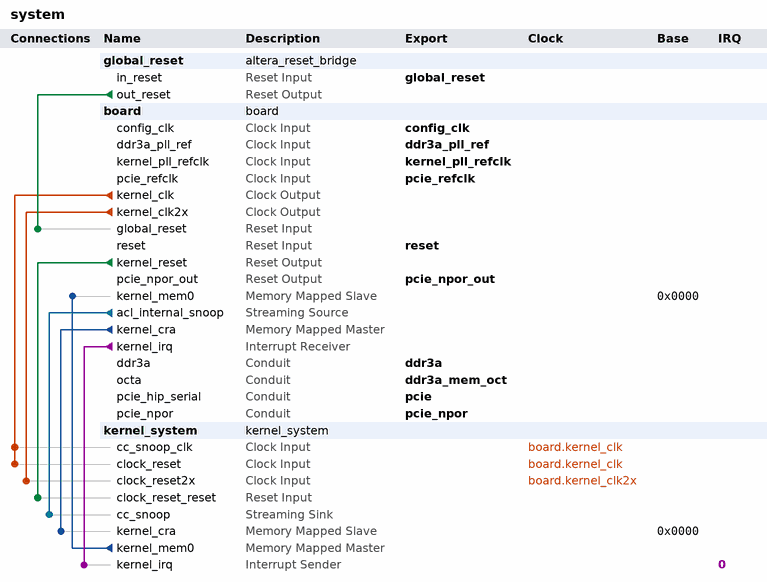
[diagram p0: system contents]
# Platform Designer (Qsys) system system, Cyclone V 5CGXFC9D6F27C7
# Parameters at their usual value, and those the tool derives, are not listed.
package require -exact qsys 18.1
create_system system
set_project_property DEVICE_FAMILY {Cyclone V}
set_project_property DEVICE 5CGXFC9D6F27C7

add_instance global_reset altera_reset_bridge 18.1
set_instance_parameter_value global_reset ACTIVE_LOW_RESET 1
set_instance_parameter_value global_reset SYNCHRONOUS_EDGES none

add_instance board board 1.0

add_instance kernel_system kernel_system 1.0

# connections
add_connection board.kernel_clk kernel_system.cc_snoop_clk clock
add_connection board.kernel_clk kernel_system.clock_reset clock
add_connection board.kernel_clk2x kernel_system.clock_reset2x clock
add_connection board.kernel_reset kernel_system.clock_reset_reset reset
add_connection global_reset.out_reset board.global_reset reset
add_connection board.kernel_cra kernel_system.kernel_cra avalon
set_connection_parameter_value board.kernel_cra/kernel_system.kernel_cra baseAddress 0x0000
add_connection kernel_system.kernel_mem0 board.kernel_mem0 avalon
set_connection_parameter_value kernel_system.kernel_mem0/board.kernel_mem0 baseAddress 0x0000
add_connection board.acl_internal_snoop kernel_system.cc_snoop avalon_streaming
add_connection board.kernel_irq kernel_system.kernel_irq interrupt
set_connection_parameter_value board.kernel_irq/kernel_system.kernel_irq irqNumber 0

# exported interfaces
add_interface config_clk clock sink
set_interface_property config_clk EXPORT_OF board.config_clk
add_interface ddr3a conduit end
set_interface_property ddr3a EXPORT_OF board.ddr3a
add_interface ddr3a_mem_oct conduit end
set_interface_property ddr3a_mem_oct EXPORT_OF board.octa
add_interface ddr3a_pll_ref clock sink
set_interface_property ddr3a_pll_ref EXPORT_OF board.ddr3a_pll_ref
add_interface global_reset reset sink
set_interface_property global_reset EXPORT_OF global_reset.in_reset
add_interface kernel_pll_refclk clock sink
set_interface_property kernel_pll_refclk EXPORT_OF board.kernel_pll_refclk
add_interface pcie conduit end
set_interface_property pcie EXPORT_OF board.pcie_hip_serial
add_interface pcie_npor conduit end
set_interface_property pcie_npor EXPORT_OF board.pcie_npor
add_interface pcie_npor_out reset source
set_interface_property pcie_npor_out EXPORT_OF board.pcie_npor_out
add_interface pcie_refclk clock sink
set_interface_property pcie_refclk EXPORT_OF board.pcie_refclk
add_interface reset reset sink
set_interface_property reset EXPORT_OF board.reset

set_interconnect_requirement {$system} qsys_mm.clockCrossingAdapter FIFO
set_interconnect_requirement {$system} qsys_mm.maxAdditionalLatency 0

save_system system.qsys
